# Altium project Overall.PrjPcb
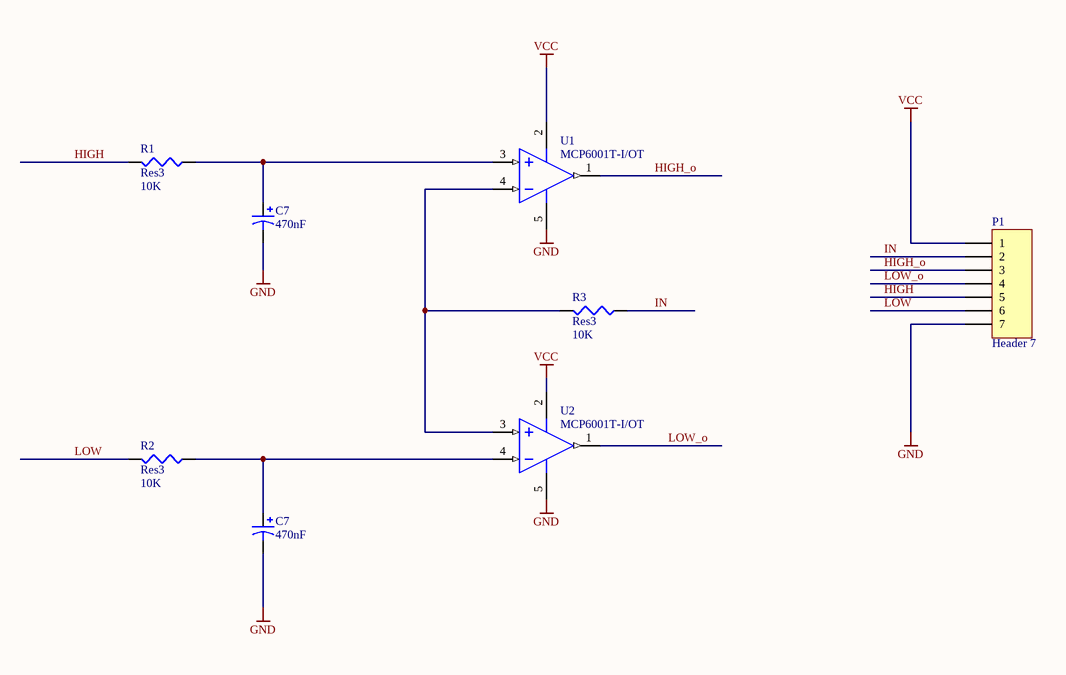
[diagram p0: 2 - Window Comparator.SchDoc]
1 sheet, 8 parts. Net scope: global (net labels, ports and power ports of the same name join across sheets).
Board file: Window Comparator.PcbDoc

## Sheet 2 - Window Comparator.SchDoc
size A4

### Parts
(Parts that share a designator on the sheet are numbered #1, #2 ... from top to bottom, then left to right.)
C7#1  value 470nF  [C0805]  (hidden comment: Cap Pol3)
C7#2  value 470nF  [C0805]  (hidden comment: Cap Pol3)
P1  Header 7  [HDR1X7]
R1  Res3  value 10K  [J1-0603]
R2  Res3  value 10K  [J1-0603]
R3  Res3  value 10K  [J1-0603]
U1  MCP6001T-I/OT  [SOT-23-OT5_N]
U2  MCP6001T-I/OT  [SOT-23-OT5_N]

### Nets
GND: C7#1.2 C7#2.2 P1.7 U1.5(VDD) U2.5(VDD)
VCC: P1.1 U1.2(VSS) U2.2(VSS)
HIGH: P1.5 R1.2
HIGH_o: P1.3 U1.1(VOUT)
IN: P1.2 R3.1
LOW: P1.6 R2.2
LOW_o: P1.4 U2.1(VOUT)
NetC7#1_1: C7#1.1 R1.1 U1.3(VIN+)
NetC7#2_1: C7#2.1 R2.1 U2.4(VIN-)
NetR3_2: R3.2 U1.4(VIN-) U2.3(VIN+)

### Library data of the parts
C7#1 C7#2 = Cap Pol3: Polarized Capacitor (Surface Mount); Published: 8-Jun-2000; LatestRevisionDate: 29-May-2009; LatestRevisionNote: IPC-7351 Footprint Added.; PackageReference: C0805; Publisher: Altium Limited; PackageDescription: Chip Capacitor
P1 = Header 7: Header, 7-Pin; LatestRevisionDate: 17-Jul-2002; LatestRevisionNote: Re-released for DXP Platform.; Publisher: Altium Limited
R1-R3 = Res3: Resistor; Published: 8-Jun-2000; LatestRevisionDate: 29-May-2009; LatestRevisionNote: IPC-7351 Footprint Added.; PackageReference: J1-0603; Publisher: Altium Limited; PackageDescription: Chip Resistor
U1 U2 = MCP6001T-I/OT: 1 MHz, Low-Power Operational Amplifier, 5-Pin SOT-23, Industrial Temperature, Tape and Reel; Published: 29-Jan-2009; LatestRevisionDate: 02-Dec-2009; LatestRevisionNote: Updated to datasheet revision J, Nov-2009; DatasheetVersion: revJ, Nov-2009; PackageVersion: revBB, Aug-2009; PackageReference: SOT-23-OT5; Publisher: Altium Limited; PackageDescription: 5-Lead Plastic Small Outline Transistor (OT) [SOT-23]; Supplier 1: Digi-Key; Supplier Part Number 1: MCP6001T-I/OTTR-ND; Supplier 2: Digi-Key; Supplier Part Number 2: MCP6001T-I/OTCT-ND; Supplier 3: Digi-Key; Supplier Part Number 3: MCP6001T-I/OTDKR-ND; Supplier 4: Farnell; Supplier Part Number 4: 4974992RL; Supplier 5: Farnell; Supplier Part Number 5: 4974992; Code_IPC: SOT23-5; ComponentLink1Description: Datasheet; ComponentLink1URL: http://ww1.microchip.com/downloads/en/DeviceDoc/21733j.pdf; ComponentLink2Description: Packaging Specification; ComponentLink2URL: http://www.microchip.com/stellent/groups/techpub_sg/documents/packagingspec/en012702.pdf; ComponentLink3Description: Microchip.com Home; ComponentLink3URL: http://www.microchip.com/